# EAGLE schematic COB-LED driver Schematics_v1.1 (EAGLE 9.6.2)
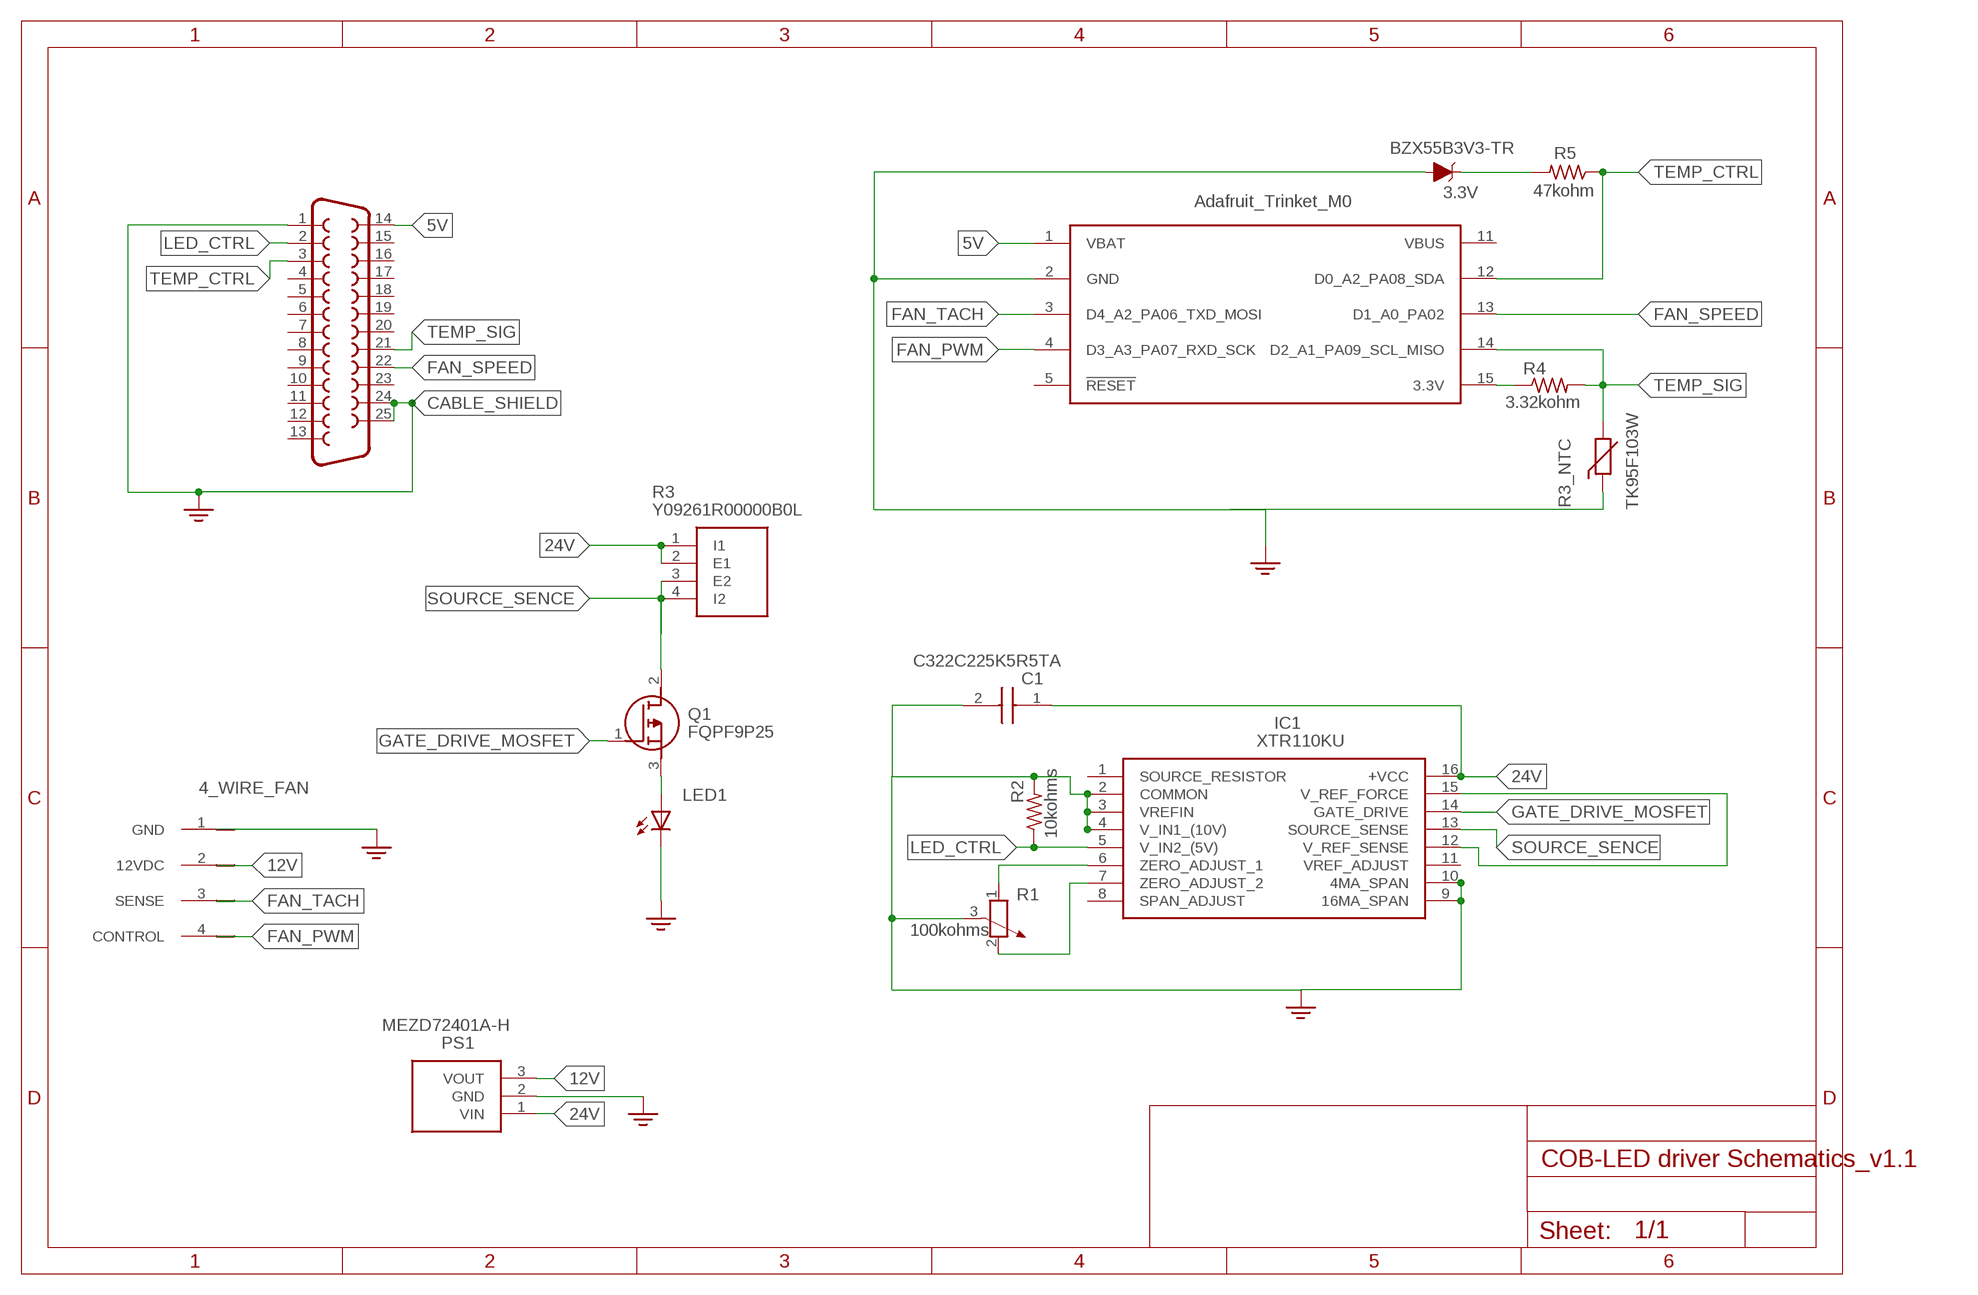
[diagram p0: schematic, sheet 1]

## Parts
C1  C322C225K5R5TA  [C322C225K5R5TA]
D1  3.3V  DIODE-ZENER-BZT52C3V6S  [SOD-323]
IC1  XTR110KU  [SOIC127P1030X265-16N]
LED1  LED  [SMARTLED-TTW]
PS1  MEZD72401A-H  [MEZD72401AH]
Q1  FQPF9P25  [TO254P490X1016X1970-3P]
R1  100kohms  POTENTIOMETER_PT-10  [PT-10]
R2  10kohms  R-US_0309/V  [0309V]
R3  Y09261R00000B0L  [TO254P401X1016X2196-4P]
R3_NTC  THERMISTOR_R-2,5  [RS-2,5]
R4  3.32kohm  R-US_0309/V  [0309V]
R5  47kohm  R-US_0309/V  [0309V]
U$1  LAMP_IRGA_V1LAMP_IRGA_V1_3D  [SOIC127P1032X265-20N]
U$2  4-WIRE-PIN-FAN4-WIRE-PIN-FAN  [HDRV4W64P254_1X4_1016X508X838B]
X1  F25VP  [F25VP]

## Nets
3.3V: LED1.C@1(C) PS1.2(GND) ; supply symbol labelled GND2
4_WIRE_FAN: U$2.1(GND) ; supply symbol labelled GND2
5V: U$1.1(VBAT) X1.14
12V: PS1.3(VOUT) U$2.2(12VDC)
24V: C1.1 IC1.16(+VCC) PS1.1(VIN) R3.1(I1) R3.2(E1)
100KOHMS: C1.2 IC1.2(COMMON) IC1.3(VREFIN) IC1.4(V_IN1_(10V)) IC1.9(16MA_SPAN) IC1.10(4MA_SPAN) R1.3 R2.2 ; supply symbol labelled GND2
BZX55B3V3-TR: D1.A U$1.2(GND) ; supply symbol labelled GND2
CABLE_SHIELD: X1.1 X1.24 X1.25 ; supply symbol labelled GND2
FAN_PWM: U$1.4(D3_A3_PA07_RXD_SCK) U$2.4(CONTROL)
FAN_SPEED: X1.22
FAN_TACH: U$2.3(SENSE)
GATE_DRIVE_MOSFET: IC1.14(GATE_DRIVE) Q1.1(G)
LED_CTRL: IC1.5(V_IN2_(5V)) R2.1 X1.2
N$1: IC1.12(V_REF_SENSE) IC1.15(V_REF_FORCE)
N$2: LED1.A@1(A) Q1.3(S)
N$3: U$1.13(D1_A0_PA02)
N$4: IC1.6(ZERO_ADJUST_1) R1.1
N$5: U$1.3(D4_A2_PA06_TXD_MOSI)
N$6: R4.1 U$1.15(3.3V)
N$7: IC1.7(ZERO_ADJUST_2) R1.2
N$9: D1.C R5.2
SOURCE_SENCE: IC1.13(SOURCE_SENSE) Q1.2(D) R3.3(E2) R3.4(I2)
TEMP_CTRL: R5.1 U$1.12(D0_A2_PA08_SDA) X1.3
TEMP_SIG: R3_NTC.2 R4.2 U$1.14(D2_A1_PA09_SCL_MISO) X1.21
TK95F103W: R3_NTC.1
Unconnected: IC1.1(SOURCE_RESISTOR) IC1.8(SPAN_ADJUST) IC1.11(VREF_ADJUST) U$1.5(!RESET) U$1.11(VBUS) X1.4 X1.5 X1.6 X1.7 X1.8 X1.9 X1.10 X1.11 X1.12 X1.13 X1.15 X1.16 X1.17 X1.18 X1.19 X1.20 X1.23

## Library data of the parts
C1 = C322C225K5R5TA:C322C225K5R5TA: KEMET C322C225K5R5TA 2.2F MLCC 50V dc +/-10% Tolerance Through Hole Source: Datasheet <https://www.kemet.com/specsheet/C322C225K5R5TA>; DESCRIPTION: KEMET C322C225K5R5TA 2.2F MLCC 50V dc +/-10% Tolerance Through Hole; HEIGHT: 6.6mm; MANUFACTURER_NAME: KEMET; MANUFACTURER_PART_NUMBER: C322C225K5R5TA
D1 = SparkFun-DiscreteSemi:DIODE-ZENER: Zener Diode A Zener diode allows current to flow from its anode to its cathode like a normal semiconductor diode, but it also permits current to flow in the reverse direction when its "Zener voltage" is reached. - WIkipedia; PROD_ID: DIO-08199; VALUE: 3.6V
IC1 = SamacSys_Parts:XTR110KU: Precision Voltage-To-Current Converter/Transmitter Source: Datasheet; DESCRIPTION: Precision Voltage-To-Current Converter/Transmitter; HEIGHT: 2.65mm; MANUFACTURER_NAME: Texas Instruments; MANUFACTURER_PART_NUMBER: XTR110KU; MOUSER_PART_NUMBER: 595-XTR110KU; MOUSER_PRICE-STOCK: https://www.mouser.com/Search/Refine.aspx?Keyword=595-XTR110KU
LED1 = adafruit:LED: LED OSRAM: - CHIPLED LG R971, LG N971, LY N971, LG Q971, LY Q971, LO R971, LY R971 LH N974, LH R974 LS Q976, LO Q976, LY Q976 LO Q996 - Hyper CHIPLED LW Q18S LB Q993, LB Q99A, LB R99A - SideLED LS A670, LO A670, LY A670, LG A670, LP A670 LB A673, LV A673, LT A673, LW A673 LH A674 LY A675 LS A676, LA A676, LO A676, LY A676, LW A676 LS A679, LY A679, LG A679 - Hyper Micro SIDELED® LS Y876, LA Y876, LO Y876, LY Y876 LT Y87S - SmartLED LW L88C, LW L88S LB L89C, LB L89S, LG L890 LS L89K, LO L89K, LY L89K LS L896, LA L896, LO L896, LY L896 - TOPLED LS T670, LO T670, LY T670, LG T670, LP T670 LSG T670, LSP T670, LSY T670, LOP T670, LYG T670 LG T671, LOG T671, LSG T671 LB T673, LV T673, LT T673, LW T673 LH T674 LS T676, LA T676, LO T676, LY T676, LB T676, LH T676, LSB T676, LW T676 LB T67C, LV T67C, LT T67C, LS T67K, LO T67K, LY T67K, LW E67C LS E67B, LA E67B, LO E67B, LY E67B, LB E67C, LV E67C, LT E67C LW T67C LS T679, LY T679, LG T679 LS T770, LO T770, LY T770, LG T770, LP T770 LB T773, LV T773, LT T773, LW T773 LH T774 LS E675, LA E675, LY E675, LS T675 LS T776, LA T776, LO T776, LY T776, LB T776 LHGB T686 LT T68C, LB T68C - Hyper Mini TOPLED® LB M676 - Mini TOPLED Santana® LG M470 LS M47K, LO M47K, LY M47K Source: http://www.osram.convergy.de/
PS1 = mEZD72401A-H:MEZD72401A-H: Non-Isolated DC/DC Converters 12V 1A DC/DC Power Supply Source: Datasheet <https://componentsearchengine.com/Datasheets/1/mEZD72401A-H.pdf>; DESCRIPTION: Non-Isolated DC/DC Converters 12V 1A DC/DC Power Supply; HEIGHT: 20mm; MANUFACTURER_NAME: Monolithic Power Systems (MPS); MANUFACTURER_PART_NUMBER: mEZD72401A-H; MOUSER_PART_NUMBER: 946-MEZD72401A-H; MOUSER_PRICE-STOCK: https://www.mouser.com/Search/Refine.aspx?Keyword=946-MEZD72401A-H
Q1 = SamacSys_Parts:FQPF9P25: FQPF9P25 P-Channel MOSFET, 3.9 A, 250 V QFET, 3-Pin TO-220F ON Semiconductor Source: Datasheet <https://componentsearchengine.com/Datasheets/1/FQPF9P25.pdf>; DESCRIPTION: FQPF9P25 P-Channel MOSFET, 3.9 A, 250 V QFET, 3-Pin TO-220F ON Semiconductor; HEIGHT: 4.9mm; MANUFACTURER_NAME: ON Semiconductor; MANUFACTURER_PART_NUMBER: FQPF9P25; MOUSER_PART_NUMBER: 512-FQPF9P25; MOUSER_PRICE-STOCK: https://www.mouser.com/Search/Refine.aspx?Keyword=512-FQPF9P25
R1 = rcl:POTENTIOMETER_: Potentiometer; SPICEMODEL: POT; SPICEPREFIX: X
R2 R4 R5 = rcl:R-US_: RESISTOR, American symbol; SPICEPREFIX: R
R3 = Y09261R00000B0L:Y09261R00000B0L: Metal Foil Resistors - Through Hole 1ohms 0.1% TO-220 8w Source: Datasheet <http://www.mouser.com/ds/2/428/vpr22021-5184.pdf>; ARROW_PART_NUMBER: Y09261R00000B0L; ARROW_PRICE-STOCK: https://www.arrow.com/en/products/y09261r00000b0l/vishay-precision-group?region=nac; DESCRIPTION: Metal Foil Resistors - Through Hole 1ohms 0.1% TO-220 8w; HEIGHT: 4.01mm; MANUFACTURER_NAME: Vishay; MANUFACTURER_PART_NUMBER: Y09261R00000B0L; MOUSER_PART_NUMBER: 71-VPR221-B-1; MOUSER_PRICE-STOCK: https://www.mouser.co.uk/ProductDetail/Vishay-Precision-Group-Foil-Resistors/Y09261R00000B0L?qs=eOkWhNjDCjhjbDaZFlSoow%3D%3D
R3_NTC = discrete:THERMISTOR_: Thermo Resistor
U$1 = Lamp_irga:LAMP_IRGA_V1
U$2 = Lamp_irga:4-WIRE-PIN-FAN
X1 = con-subd:F25: SUB-D; OC_FARNELL: unknown; OC_NEWARK: unknown